# Altium project rf_communications_board.PrjPcb
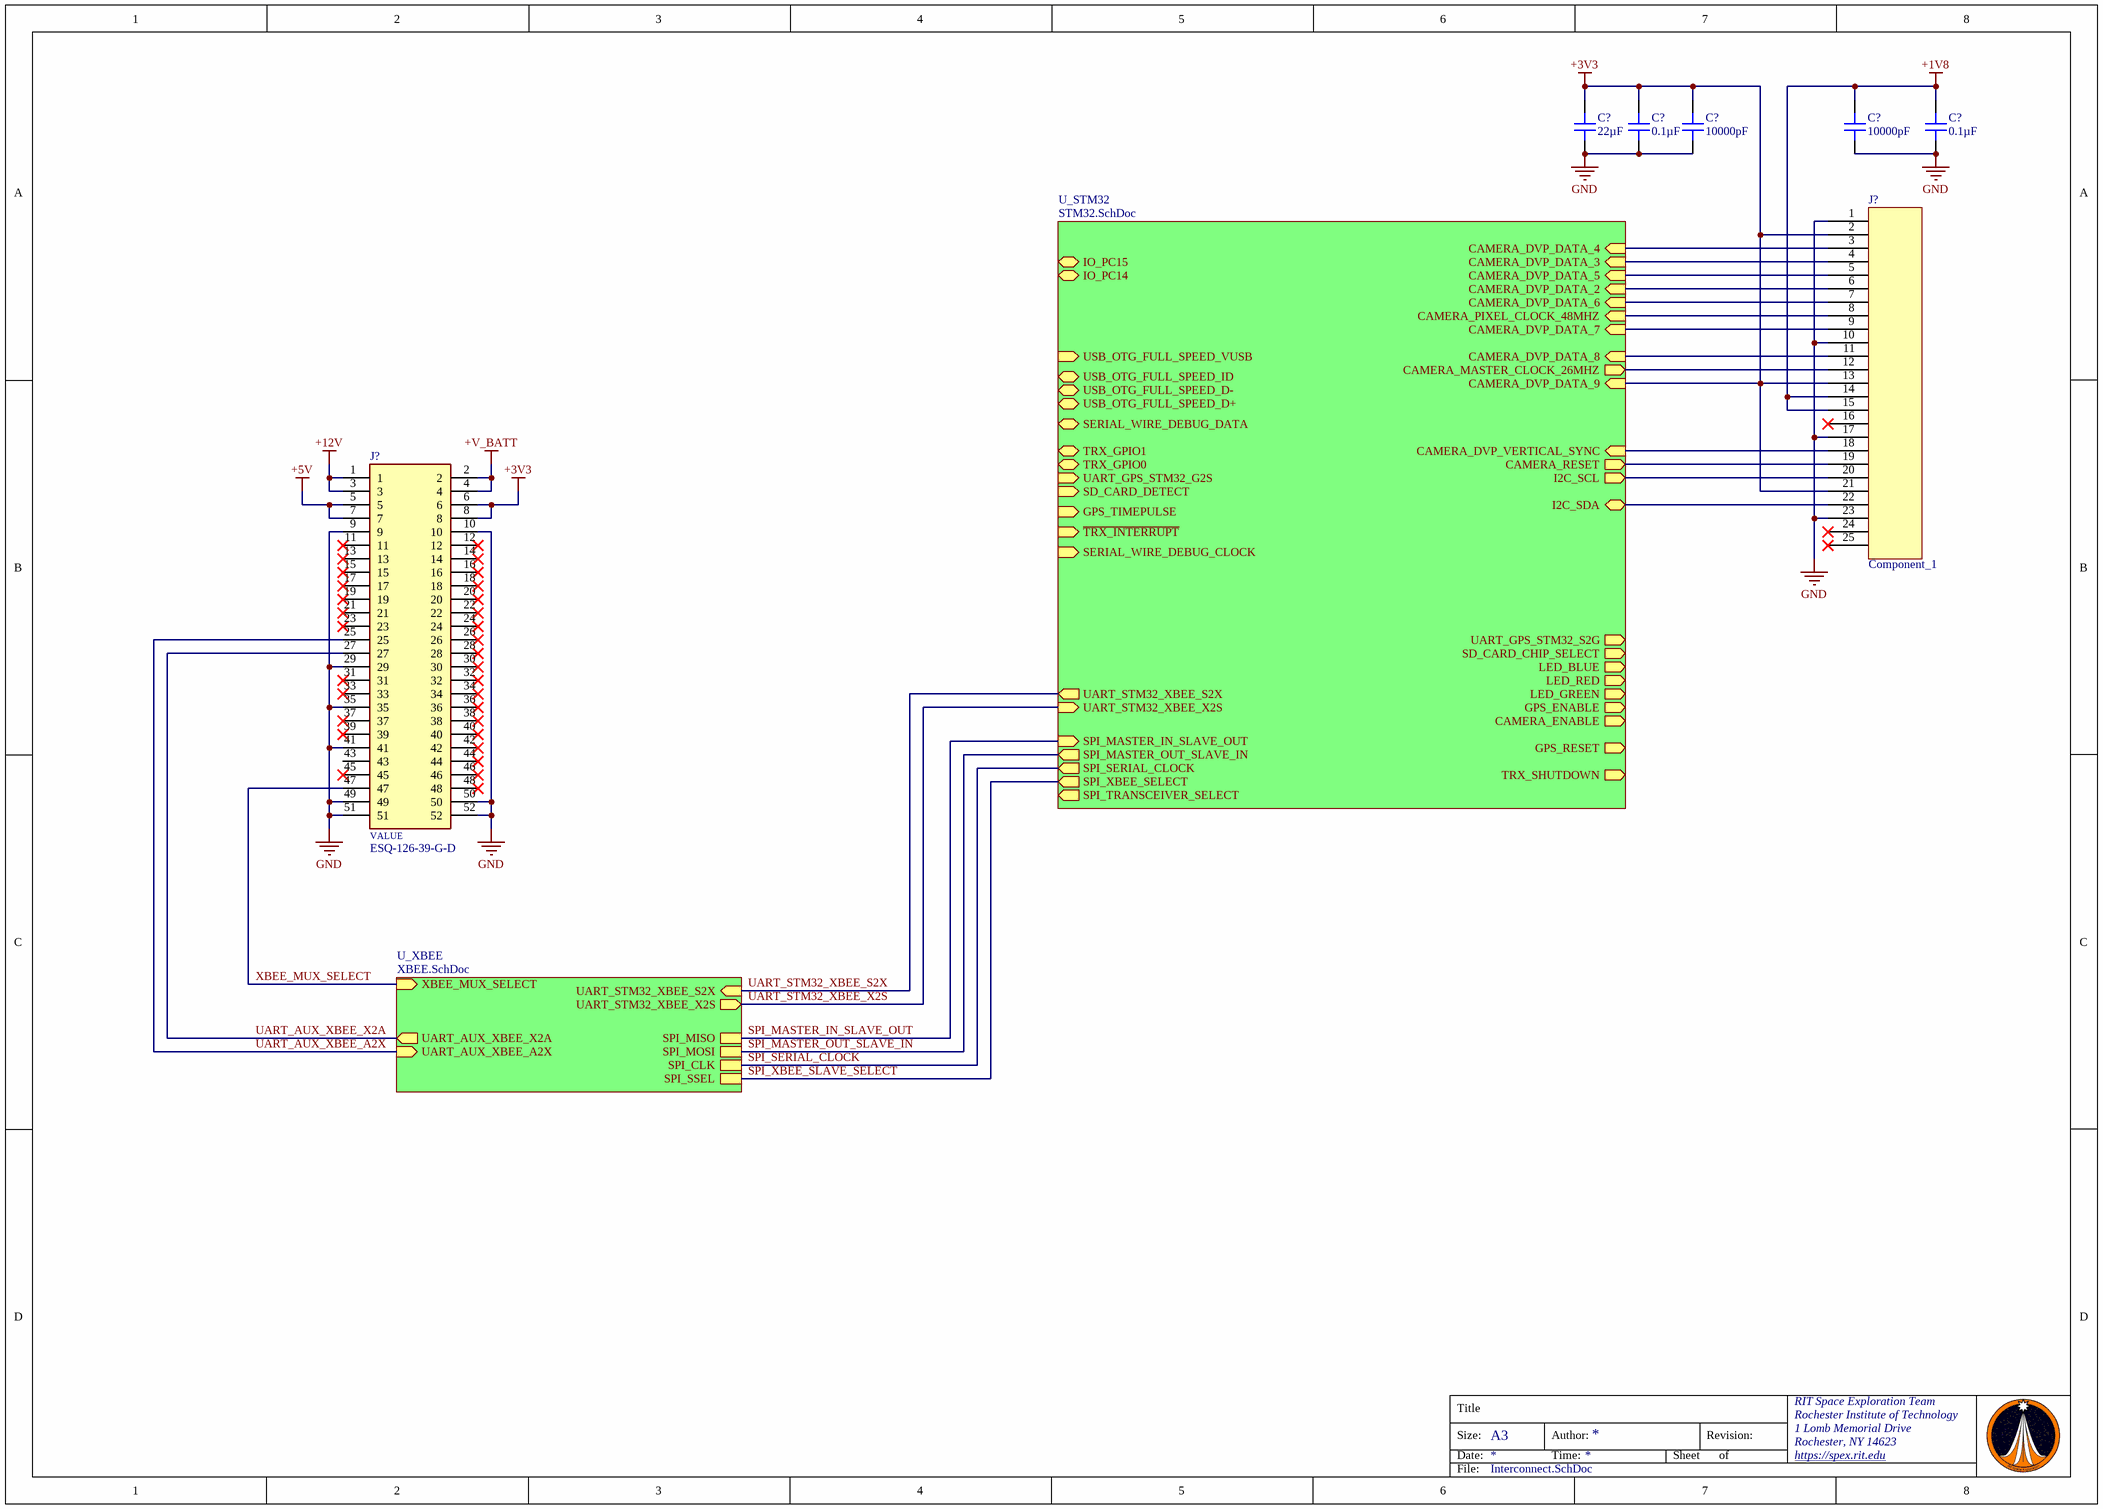
[diagram p0: Interconnect.SchDoc]
1 sheet, 7 parts. Net scope: hierarchical (ports join the sheet entries above them; power ports are global).

## Sheet Interconnect.SchDoc
size A3; Organization: RIT/SPEX; Address1: Rochester Institute of Technology; Address2: Rochester; Address3: New York; Address4: USA

### Parts
(Parts that share a designator on the sheet are numbered #1, #2 ... from top to bottom, then left to right.)
C?#1  22µF  [CAP 0805_2012]
C?#2  0.1µF  [CAP 0603_1608]
C?#3  10000pF  [CAP 0603_1608]
C?#4  10000pF  [CAP 0603_1608]
C?#5  0.1µF  [CAP 0603_1608]
J?#1  Component_1
J?#2  ESQ-126-39-G-D  [SAMTEC_ESQ-126-39-G-D]

### Sub-sheets
U_STM32 = STM32.SchDoc (file not in this document): IO_PC15 (bidir), IO_PC14 (bidir), CAMERA_DVP_DATA_2 (in), CAMERA_DVP_DATA_3 (in), CAMERA_DVP_DATA_4 (in), CAMERA_DVP_DATA_5 (in), CAMERA_DVP_DATA_6 (in), CAMERA_DVP_DATA_7 (in), CAMERA_DVP_DATA_8 (in), CAMERA_DVP_DATA_9 (in), SPI_XBEE_SELECT (out), USB_OTG_FULL_SPEED_VUSB (in), USB_OTG_FULL_SPEED_ID (bidir), USB_OTG_FULL_SPEED_D- (bidir), USB_OTG_FULL_SPEED_D+ (bidir), SERIAL_WIRE_DEBUG_DATA (bidir), CAMERA_RESET (out), SPI_SERIAL_CLOCK (out), SPI_MASTER_IN_SLAVE_OUT (in), SPI_MASTER_OUT_SLAVE_IN (out), TRX_GPIO1 (bidir), TRX_GPIO0 (bidir), I2C_SDA (bidir), I2C_SCL (out), UART_GPS_STM32_G2S (in), UART_GPS_STM32_S2G (out), CAMERA_DVP_VERTICAL_SYNC (in), SD_CARD_CHIP_SELECT (out), LED_BLUE (out), LED_RED (out), LED_GREEN (out), GPS_ENABLE (out), CAMERA_PIXEL_CLOCK_48MHZ (in), CAMERA_ENABLE (out), SD_CARD_DETECT (in), SPI_TRANSCEIVER_SELECT (out), GPS_TIMEPULSE (in), ~{TRX_INTERRUPT} (in), SERIAL_WIRE_DEBUG_CLOCK (in), GPS_RESET (out), CAMERA_MASTER_CLOCK_26MHZ (out), TRX_SHUTDOWN (out), UART_STM32_XBEE_X2S (in), UART_STM32_XBEE_S2X (out)
U_XBEE = XBEE.SchDoc (file not in this document): SPI_MOSI, SPI_SSEL, SPI_CLK, SPI_MISO, UART_AUX_XBEE_A2X (in), UART_AUX_XBEE_X2A (out), UART_STM32_XBEE_X2S (out), UART_STM32_XBEE_S2X (in), XBEE_MUX_SELECT (in)

### Nets
+1V8: C?#4.2 C?#5.1 J?#1.14 J?#1.15
+3V3: C?#1.2 C?#2.1 C?#3.2 J?#1.2 J?#1.13 J?#1.21 J?#2.6 J?#2.8 ; sheet U_STM32/CAMERA_DVP_DATA_9
+5V: J?#2.5 J?#2.7
+12V: J?#2.1 J?#2.3
+V_BATT: J?#2.2 J?#2.4
GND: C?#1.1 C?#2.2 C?#3.1 C?#4.1 C?#5.2 J?#1.1 J?#1.10 J?#1.17 J?#1.23 J?#2.9 J?#2.10 J?#2.29 J?#2.35 J?#2.41 J?#2.49 J?#2.50 J?#2.51 J?#2.52
SPI_MASTER_IN_SLAVE_OUT: sheet U_STM32/SPI_MASTER_IN_SLAVE_OUT, sheet U_XBEE/SPI_MISO
SPI_MASTER_OUT_SLAVE_IN: sheet U_STM32/SPI_MASTER_OUT_SLAVE_IN, sheet U_XBEE/SPI_MOSI
SPI_SERIAL_CLOCK: sheet U_STM32/SPI_SERIAL_CLOCK, sheet U_XBEE/SPI_CLK
SPI_XBEE_SLAVE_SELECT: sheet U_STM32/SPI_XBEE_SELECT, sheet U_XBEE/SPI_SSEL
UART_AUX_XBEE_A2X: J?#2.25 ; sheet U_XBEE/UART_AUX_XBEE_A2X
UART_AUX_XBEE_X2A: J?#2.27 ; sheet U_XBEE/UART_AUX_XBEE_X2A
UART_STM32_XBEE_S2X: sheet U_STM32/UART_STM32_XBEE_S2X, sheet U_XBEE/UART_STM32_XBEE_S2X
UART_STM32_XBEE_X2S: sheet U_STM32/UART_STM32_XBEE_X2S, sheet U_XBEE/UART_STM32_XBEE_X2S
XBEE_MUX_SELECT: J?#2.47 ; sheet U_XBEE/XBEE_MUX_SELECT
NetJ?#1_3: J?#1.3 ; sheet U_STM32/CAMERA_DVP_DATA_4
NetJ?#1_4: J?#1.4 ; sheet U_STM32/CAMERA_DVP_DATA_3
NetJ?#1_5: J?#1.5 ; sheet U_STM32/CAMERA_DVP_DATA_5
NetJ?#1_6: J?#1.6 ; sheet U_STM32/CAMERA_DVP_DATA_2
NetJ?#1_7: J?#1.7 ; sheet U_STM32/CAMERA_DVP_DATA_6
NetJ?#1_8: J?#1.8 ; sheet U_STM32/CAMERA_PIXEL_CLOCK_48MHZ
NetJ?#1_9: J?#1.9 ; sheet U_STM32/CAMERA_DVP_DATA_7
NetJ?#1_11: J?#1.11 ; sheet U_STM32/CAMERA_DVP_DATA_8
NetJ?#1_12: J?#1.12 ; sheet U_STM32/CAMERA_MASTER_CLOCK_26MHZ
NetJ?#1_18: J?#1.18 ; sheet U_STM32/CAMERA_DVP_VERTICAL_SYNC
NetJ?#1_19: J?#1.19 ; sheet U_STM32/CAMERA_RESET
NetJ?#1_20: J?#1.20 ; sheet U_STM32/I2C_SCL
NetJ?#1_22: J?#1.22 ; sheet U_STM32/I2C_SDA

Not connected (* = marked no-connect by the designer): J?#1 16* 24* 25*; J?#2 11* 12* 13* 14* 15* 16* 17* 18* 19* 20* 21* 22* 23* 24* 26* 28* 30* 31* 32* 33* 34* 36* 37* 38* 39* 40* 42* 43 44* 45* 46* 48*

### Notes on the sheet
- Title
- Size:
- Date:
- A3
- Author:
- Time:
- Sheet
- Revision:
- of
- RIT Space Exploration Team
- Rochester Institute of Technology
- 1 Lomb Memorial Drive
- Rochester, NY 14623
- https://spex.rit.edu
- File:
- (in symbol ESQ-126-39-G-D) VALUE

### Library data of the parts
C?#1 = GRM21BR61A226ME44L: CAP CER 22UF 10V X5R 0805; Manufacturer: Murata Electronics; Tolerance: ±20%; Part Number: GRM21BR61A226ME44L; Value: 22µF; Applications: General Purpose; Capacitance: 22µF; ComponentLink1Description: Datasheet; ComponentLink1URL: https://search.murata.co.jp/Ceramy/image/img/A01X/G101/ENG/GRM21BR61A226ME44-01.pdf; ComponentLink2Description: DigiKey Link; ComponentLink2URL: http://digikey.com/product-detail/en/murata-electronics/GRM21BR61A226ME44L/490-10746-1-ND/5251354; Device Package: 0805 (2012 Metric); LastUpdated: 1/21/2020 12:03:01 AM; Lifecycle Status: Active; Minimum Order: 1; Mounting Type: Surface Mount, MLCC; Operating Temperature: -55°C ~ 85°C; Package / Case: 0805 (2012 Metric); Packaging: TapeAndReel; PartId: 6027; Part Status: Active; Price: 0.13; Series: GRM; Size / Dimension: 0.079" L x 0.049" W (2.00mm x 1.25mm); Supplier 1: DigiKey; Supplier Part Number 1: 490-10746-1-ND; Temperature Coefficient: X5R; Thickness (Max): 0.057" (1.45mm); Voltage - Rated: 10V
C?#2 C?#5 = 100X14W104MV4T: CAP CER 0.1UF 10V X7R 0603; Manufacturer: Johanson Dielectrics Inc.; Tolerance: ±20%; Part Number: 100X14W104MV4T; Value: 0.1µF; Applications: Bypass, Decoupling; Capacitance: 0.1µF; ComponentLink1Description: Datasheet; ComponentLink1URL: https://www.johansondielectrics.com/downloads/x2y-filter-and-decoupling-capacitors.pdf; ComponentLink2Description: DigiKey Link; ComponentLink2URL: http://digikey.com/product-detail/en/johanson-dielectrics-inc/100X14W104MV4T/709-1101-1-ND/1655915; Device Package: 0603 (1608 Metric); Features: Low ESL (X2Y); LastUpdated: 1/21/2020 12:02:09 AM; Lifecycle Status: Active; Minimum Order: 1; Mounting Type: Surface Mount, MLCC; Operating Temperature: -55°C ~ 125°C; Package / Case: 0603 (1608 Metric); Packaging: TapeAndReel; PartId: 2680; Part Status: Active; Price: 0.11; Series: X2Y®; Size / Dimension: 0.064" L x 0.035" W (1.63mm x 0.89mm); Supplier 1: DigiKey; Supplier Part Number 1: 709-1101-1-ND; Temperature Coefficient: X7R; Thickness (Max): 0.026" (0.66mm); Voltage - Rated: 10V
C?#3 C?#4 = C0603S103K4RACTU: CAP CER 10000PF 16V X7R 0603; Manufacturer: KEMET; Tolerance: ±10%; Part Number: C0603S103K4RACTU; Value: 10000pF; Applications: Boardflex Sensitive; Capacitance: 10000pF; ComponentLink1Description: Datasheet; ComponentLink1URL: https://api.kemet.com/component-edge/download/datasheet/C0603S103K4RACTU.pdf; ComponentLink2Description: DigiKey Link; ComponentLink2URL: http://digikey.com/product-detail/en/kemet/C0603S103K4RACTU/399-9135-1-ND/3522653; Device Package: 0603 (1608 Metric); Features: Floating Electrode; LastUpdated: 1/21/2020 12:02:08 AM; Lifecycle Status: Active; Minimum Order: 1; Mounting Type: Surface Mount, MLCC; Operating Temperature: -55°C ~ 125°C; Package / Case: 0603 (1608 Metric); Packaging: TapeAndReel; PartId: 3312; Part Status: Active; Price: 0.07; Series: SMD Comm X7R FE; Size / Dimension: 0.063" L x 0.031" W (1.60mm x 0.80mm); Supplier 1: DigiKey; Supplier Part Number 1: 399-9135-1-ND; Temperature Coefficient: X7R; Thickness (Max): 0.034" (0.87mm); Voltage - Rated: 16V
J?#2 = ESQ-126-39-G-D: 52 Position Elevated Socket Connector Through Hole; MF: Samtec; Value: *; Digi-Key_Purchase_URL: https://www.digikey.com/product-detail/en/samtec-inc/ESQ-126-39-G-D/SAM10462-ND/3601055?utm_source=snapeda&utm_medium=aggregator&utm_campaign=symbol; Package: None; MP: ESQ-126-39-G-D; SnapEDA_Link: https://www.snapeda.com/parts/ESQ-126-39-G-D/Samtec%20Inc./view-part/490181/?ref=snap; Digi-Key_Part_Number: SAM10462-ND